# EAGLE design time-led-r1 (EAGLE 6.5.0)
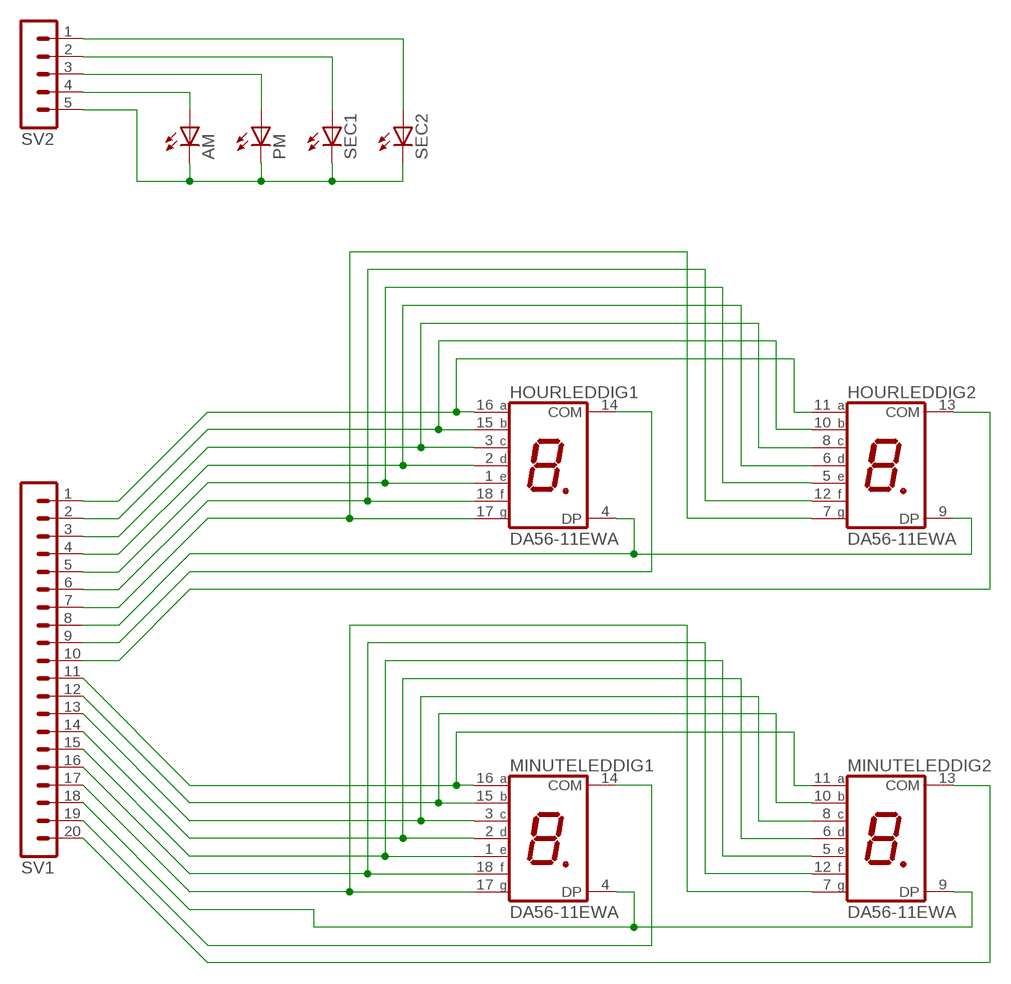
[diagram p0: schematic, sheet 1]

## Parts
AM  LED3MM  [LED3MM]
HOURLED  DA56-11EWA  [DA56]
MINUTELED  DA56-11EWA  [DA56]
PM  LED3MM  [LED3MM]
SEC1  LED3MM  [LED3MM]
SEC2  LED3MM  [LED3MM]
SV1  MA20-1W  [MA20-1W]
SV2  MA05-1  [MA05-1]

## Nets
N$1: HOURLED.11(DIG2:A) HOURLED.16(DIG1:A) SV1.1
N$2: HOURLED.10(DIG2:B) HOURLED.15(DIG1:B) SV1.2
N$3: HOURLED.3(DIG1:C) HOURLED.8(DIG2:C) SV1.3
N$4: HOURLED.2(DIG1:D) HOURLED.6(DIG2:D) SV1.4
N$5: HOURLED.1(DIG1:E) HOURLED.5(DIG2:E) SV1.5
N$6: HOURLED.12(DIG2:F) HOURLED.18(DIG1:F) SV1.6
N$7: HOURLED.7(DIG2:G) HOURLED.17(DIG1:G) SV1.7
N$8: HOURLED.4(DIG1:DP) HOURLED.9(DIG2:DP) SV1.8
N$9: MINUTELED.11(DIG2:A) MINUTELED.16(DIG1:A) SV1.11
N$10: MINUTELED.10(DIG2:B) MINUTELED.15(DIG1:B) SV1.12
N$11: MINUTELED.3(DIG1:C) MINUTELED.8(DIG2:C) SV1.13
N$12: MINUTELED.2(DIG1:D) MINUTELED.6(DIG2:D) SV1.14
N$13: MINUTELED.1(DIG1:E) MINUTELED.5(DIG2:E) SV1.15
N$14: MINUTELED.12(DIG2:F) MINUTELED.18(DIG1:F) SV1.16
N$15: MINUTELED.7(DIG2:G) MINUTELED.17(DIG1:G) SV1.17
N$16: MINUTELED.4(DIG1:DP) MINUTELED.9(DIG2:DP) SV1.18
N$17: HOURLED.13(DIG2:COM) SV1.10
N$19: AM.K(C) PM.K(C) SEC1.K(C) SEC2.K(C) SV2.5
N$20: HOURLED.14(DIG1:COM) SV1.9
N$21: AM.A SV2.4
N$22: PM.A SV2.3
N$23: SEC1.A SV2.2
N$24: SEC2.A SV2.1
N$26: MINUTELED.14(DIG1:COM) SV1.19
N$27: MINUTELED.13(DIG2:COM) SV1.20

## Library data of the parts
AM PM SEC1 SEC2 = led:LED: LED OSRAM: - CHIPLED LG R971, LG N971, LY N971, LG Q971, LY Q971, LO R971, LY R971 LH N974, LH R974 LS Q976, LO Q976, LY Q976 LO Q996 - Hyper CHIPLED LW Q18S LB Q993, LB Q99A, LB R99A - SideLED LS A670, LO A670, LY A670, LG A670, LP A670 LB A673, LV A673, LT A673, LW A673 LH A674 LY A675 LS A676, LA A676, LO A676, LY A676, LW A676 LS A679, LY A679, LG A679 - Hyper Micro SIDELED® LS Y876, LA Y876, LO Y876, LY Y876 LT Y87S - SmartLED LW L88C, LW L88S LB L89C, LB L89S, LG L890 LS L89K, LO L89K, LY L89K LS L896, LA L896, LO L896, LY L896 - TOPLED LS T670, LO T670, LY T670, LG T670, LP T670 LSG T670, LSP T670, LSY T670, LOP T670, LYG T670 LG T671, LOG T671, LSG T671 LB T673, LV T673, LT T673, LW T673 LH T674 LS T676, LA T676, LO T676, LY T676, LB T676, LH T676, LSB T676, LW T676 LB T67C, LV T67C, LT T67C, LS T67K, LO T67K, LY T67K, LW E67C LS E67B, LA E67B, LO E67B, LY E67B, LB E67C, LV E67C, LT E67C LW T67C LS T679, LY T679, LG T679 LS T770, LO T770, LY T770, LG T770, LP T770 LB T773, LV T773, LT T773, LW T773 LH T774 LS E675, LA E675, LY E675, LS T675 LS T776, LA T776, LO T776, LY T776, LB T776 LHGB T686 LT T68C, LB T68C - Hyper Mini TOPLED® LB M676 - Mini TOPLED Santana® LG M470 LS M47K, LO M47K, LY M47K Source: http://www.osram.convergy.de LUXEON: - LUMILED® LXK2-PW12-R00, LXK2-PW12-S00, LXK2-PW14-U00, LXK2-PW14-V00 LXK2-PM12-R00, LXK2-PM12-S00, LXK2-PM14-U00 LXK2-PE12-Q00, LXK2-PE12-R00, LXK2-PE12-S00, LXK2-PE14-T00, LXK2-PE14-U00 LXK2-PB12-K00, LXK2-PB12-L00, LXK2-PB12-M00, LXK2-PB14-N00, LXK2-PB14-P00, LXK2-PB14-Q00 LXK2-PR12-L00, LXK2-PR12-M00, LXK2-PR14-Q00, LXK2-PR14-R00 LXK2-PD12-Q00, LXK2-PD12-R00, LXK2-PD12-S00 LXK2-PH12-R00, LXK2-PH12-S00 LXK2-PL12-P00, LXK2-PL12-Q00, LXK2-PL12-R00 Source: www.luxeon.com KINGBRIGHT: KA-3528ASYC Source: www.kingbright.com
HOURLED MINUTELED = display-kingbright:DA56-11: 14.22mm (0.56INCH) DUAL DIGIT NUMERIC DISPLAYS Source: www.kingbright.com .. DA56-11SRWA.pdf; OC_FARNELL: unknown; OC_NEWARK: unknown
SV1 = con-lstb:MA20-1W: PIN HEADER; OC_FARNELL: unknown; OC_NEWARK: unknown
SV2 = con-lstb:MA05-1: PIN HEADER; OC_FARNELL: unknown; OC_NEWARK: unknown

## Board
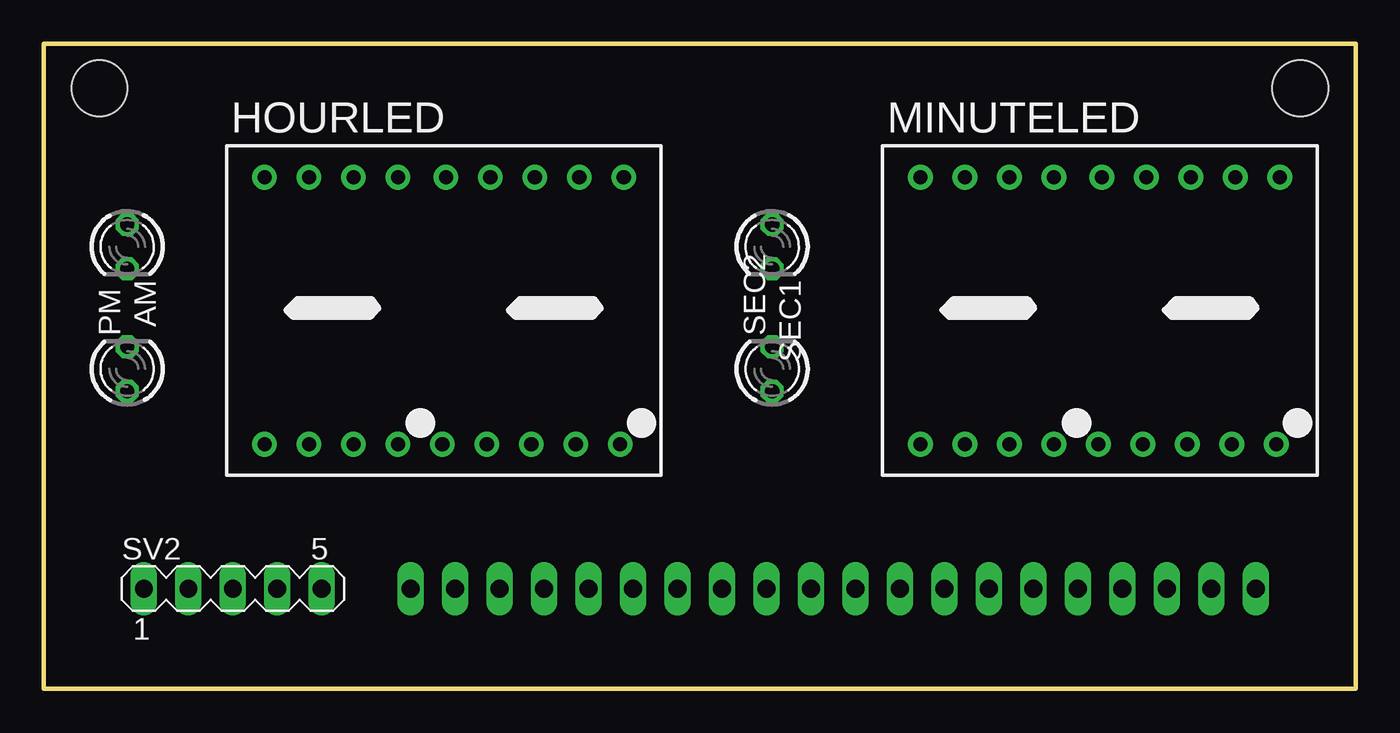
[diagram p1: board, top side]
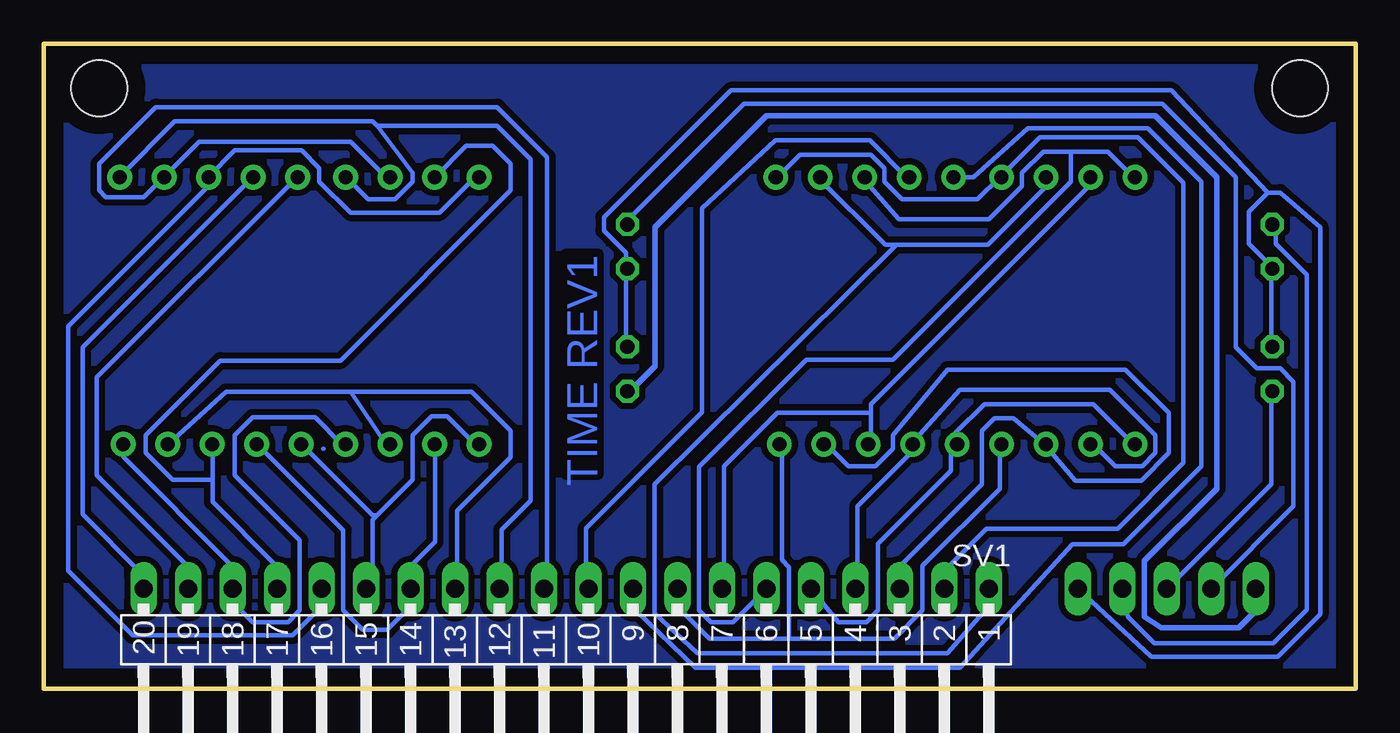
[diagram p2: board, bottom side, seen from below]

Size 74.92 x 36.82 mm. Coordinates in mm from the lower left corner, seen from the top.
Outline: 0,0 74.92,0 74.92,36.82 0,36.82 0,0
Copper layers (1*16): Top 0.035mm / dielectric 1.5mm / Bottom 0.035mm
Design rules "default *": minimum track width 10mil, minimum drill 24mil, track to track 14mil, track to pad 14mil, pad to pad 14mil, via to via 14mil, smd to smd 14mil, copper to edge 40mil, drill to drill 8mil, minimum pad ring 10mil, minimum via ring 8mil, stop-mask expansion 4mil, vias tented up to drill 0mil, thermal gap 10mil
Holes 3.2 mm at 3.17,34.29 71.75,34.29

### Footprints (pad centres in the part's own frame; a part is rotated, then mirrored left to right if it is on the bottom)
LED3MM = drill 0.813 octagon: A -1.27,0; K 1.27,0
DA56 = drill 0.8 pad 1.422: 1 -10.26,-7.62; 2 -7.72,-7.62; 3 -5.18,-7.62; 4 -2.64,-7.62; 5 -0.1,-7.62; 6 2.44,-7.62; 7 4.98,-7.62; 8 7.52,-7.62; 9 10.06,-7.62; 10 10.26,7.62; 11 7.72,7.62; 12 5.18,7.62; 13 2.64,7.62; 14 0.1,7.62; 15 -2.64,7.62; 16 -5.18,7.62; 17 -7.72,7.62; 18 -10.26,7.62
MA20-1W = drill 1.016 long: 1 -24.13,0; 2 -21.59,0; 3 -19.05,0; 4 -16.51,0; 5 -13.97,0; 6 -11.43,0; 7 -8.89,0; 8 -6.35,0; 9 -3.81,0; 10 -1.27,0; 11 1.27,0; 12 3.81,0; 13 6.35,0; 14 8.89,0; 15 11.43,0; 16 13.97,0; 17 16.51,0; 18 19.05,0; 19 21.59,0; 20 24.13,0
MA05-1 = drill 1.016 long: 1 -5.08,0; 2 -2.54,0; 3 0,0; 4 2.54,0; 5 5.08,0

### Placement (x,y rotation side)
AM  4.76,25.24 270 top
HOURLED  22.86,21.59 0 top
MINUTELED  60.33,21.59 0 top
PM  4.76,18.26 90 top
SEC1  41.59,25.24 270 top
SEC2  41.59,18.26 90 top
SV1  45.09,5.71 180 bottom
SV2  10.79,5.71 0 top

### Tracks (layer width: path | path; a pad name or v marks a point on that pad's centre or on a via)
N$1
  Bottom 0.254: 26.23,25.34 26.86,25.34 30.73,29.21 HOURLED.11 | 26.23,25.34 21.02,25.34 17.78,28.57 HOURLED.16 | 26.23,25.34 40.04,11.68 40.04,4.32 37.59,2.03 23.3,2.03 21.08,4.57 21.08,5.59 SV1.1
N$2
  Bottom 0.254: 20.32,29.21 21.59,27.94 25.91,27.94 26.92,28.96 26.92,29.72 27.69,30.48 31.75,30.48 33.02,29.21 HOURLED.10 | 20.32,29.21 18.03,31.5 12.45,31.5 9.84,28.89 9.84,12.89 13.59,9.14 21.08,9.14 23.37,6.86 23.37,5.84 SV1.2 | 20.32,29.21 HOURLED.15
N$3
  Bottom 0.254: 17.78,13.97 19.56,15.43 20.64,15.43 21.34,14.73 21.34,11.68 25.91,7.11 25.91,5.84 SV1.3 | 17.78,13.97 16,11.87 12.26,11.87 10.67,13.46 10.67,15.75 13.14,18.22 23.3,18.22 26.42,14.48 26.42,13.72 27.43,12.7 28.96,12.7 30.23,13.97 HOURLED.8 | 17.78,13.97 HOURLED.3
N$4
  Bottom 0.254: 25.4,13.97 22.61,17.08 14.03,17.08 11.43,14.48 11.43,13.46 12.19,12.7 13.72,12.7 14.99,13.97 HOURLED.2 | 25.4,13.97 25.4,13.46 28.45,10.41 28.45,5.84 SV1.4 | 25.4,13.97 HOURLED.6
N$5
  Bottom 0.254: 22.86,14.61 21.21,16.26 14.99,16.26 12.7,13.97 HOURLED.1 | SV1.5 29.53,3.81 27.94,3.81 27.27,4.48 27.27,8.29 23.11,12.45 23.11,13.72 22.86,14.61 | 22.86,14.61 HOURLED.5
N$6
  Bottom 0.254: 16.26,30.67 17.84,30.67 19.05,29.46 19.05,28.7 20.95,26.8 26.1,26.8 28.19,29.21 HOURLED.12 | 16.26,30.67 14.16,30.67 12.7,29.21 HOURLED.18 | SV1.6 35.56,3.81 36.83,3.81 37.5,4.48 37.5,12.67 31.37,18.8 26.42,18.8 16.26,28.96 16.26,30.67
N$7
  Bottom 0.254: 27.69,15.75 27.69,16.26 15.24,28.7 15.24,29.21 HOURLED.17 | 27.69,15.75 27.69,13.97 HOURLED.7 | 27.69,15.75 33.02,15.75 36.07,12.7 36.07,5.84 SV1.7
N$8
  Bottom 0.254: 32.35,2.86 36.89,2.86 38.61,4.57 38.61,5.59 SV1.8 | 32.35,2.86 26.35,2.86 24.73,4.48 24.73,7.02 20.32,11.43 20.32,13.97 HOURLED.4 | 32.35,2.86 32.35,6.95 32.77,7.37 32.77,13.97 HOURLED.9
N$9
  Bottom 0.254: 68.07,29.21 66.04,31.24 57.4,31.24 55.37,29.21 MINUTELED.16 | 68.07,29.21 69.22,28.07 71.37,28.07 71.75,28.45 71.75,29.97 68.52,33.21 49.02,33.21 46.16,30.35 46.16,6.16 SV1.11 | 68.07,29.21 MINUTELED.11
N$10
  Bottom 0.254: 55.88,32.13 56.13,32.38 67.44,32.38 70.61,29.21 MINUTELED.10 | 55.88,32.13 53.85,29.46 53.85,28.96 54.86,27.94 56.39,27.94 57.66,29.21 MINUTELED.15 | 55.88,32.13 49.02,32.13 47.12,30.23 47.12,10.73 48.77,9.08 48.77,5.84 SV1.12
N$11
  Bottom 0.254: 57.4,16.95 55.37,13.97 MINUTELED.3 | 57.4,16.95 64.52,16.95 67.82,13.97 MINUTELED.8 | 57.4,16.95 50.48,16.95 48.26,14.73 48.26,13.21 51.31,10.16 51.31,5.84 SV1.13
N$12
  Bottom 0.254: MINUTELED.2 52.58,13.97 52.58,8.38 53.85,7.11 53.85,5.84 SV1.14 54.1,5.59 54.1,4.57 55.31,3.37 56.71,3.37 57.82,4.48 57.82,9.05 62.74,13.97 MINUTELED.6
N$13
  Bottom 0.254: 55.88,9.91 56.13,9.65 56.13,6.1 SV1.15 | 55.88,9.91 53.85,11.94 53.85,14.48 52.77,15.56 51.88,15.56 50.29,13.97 MINUTELED.1 | 55.88,9.91 56.13,9.91 60.2,13.97 MINUTELED.5
N$14
  Bottom 0.254: 65.53,29.21 64.01,30.73 60.2,30.73 59.18,29.72 59.18,28.96 57.4,27.18 52.32,27.18 50.29,29.21 MINUTELED.18 | 65.53,29.21 65.53,28.7 73.53,20.7 73.53,6.73 69.85,3.05 60.71,3.05 59.18,4.57 59.18,5.59 SV1.16 | 65.53,29.21 MINUTELED.12
N$15
  Bottom 0.254: 65.28,11.94 65.28,10.67 61.72,7.11 61.72,5.84 SV1.17 | 65.28,11.94 65.28,13.97 MINUTELED.7 | 65.28,11.94 67.56,11.94 69.09,13.46 69.09,14.48 64.83,18.73 57.98,18.73 48.26,28.45 48.26,29.97 49.28,30.99 50.8,30.99 52.58,29.21 MINUTELED.17
N$16
  Bottom 0.254: MINUTELED.4 57.91,13.97 59.44,15.49 62.99,15.49 64.01,14.48 64.01,12.19 60.29,8.48 60.29,4.48 60.96,3.81 62.99,3.81 64.01,4.83 64.01,5.59 SV1.18 64.26,5.84 64.26,7.11 70.36,13.21 70.36,13.97 MINUTELED.9
N$17
  Bottom 0.254: HOURLED.13 25.65,29.21 27.75,31.3 33.15,31.3 37.34,27.43 37.34,15.78 43.94,9.18 43.94,5.84 SV1.10
N$18
  Bottom 0.254: 58.93,13.72 58.95,13.72
N$19
  Bottom 0.254: SEC2.K 41.66,19.56 41.66,23.88 SEC1.K 41.66,24.13 41.66,24.89 42.93,26.16 42.93,26.92 35.69,34.16 10.54,34.16 5.02,28.32 | PM.K 4.83,19.56 4.83,23.88 AM.K 4.83,24.13 6.1,25.4 6.1,27.24 5.02,28.32 | SV2.5 11.68,1.84 4.45,1.84 2.03,4.25 2.03,26.35 4.32,28.32 5.02,28.32
N$20
  Bottom 0.254: HOURLED.14 21.84,29.21 18.73,32 11.87,32 8.83,28.96 8.83,12.7 13.27,8.26 16.19,8.26 22.61,1.21 37.69,1.21 41.15,4.51 41.15,5.59 SV1.9
N$21
  Bottom 0.254: SV2.4 13.02,4.13 11.49,2.6 4.7,2.6 2.79,4.51 2.79,23.62 4.57,25.4 4.57,26.42 AM.A
N$22
  Bottom 0.254: SV2.3 4.83,11.68 4.83,16.76 PM.A
N$23
  Bottom 0.254: SV2.2 3.56,10.41 3.56,17.53 4.32,18.29 5.65,18.29 6.86,19.49 6.86,29.21 11.05,33.4 34.92,33.4 41.66,26.67 41.4,26.67 SEC1.A
N$24
  Bottom 0.254: 41.66,16.76 SEC2.A 41.66,17.02
  Bottom 0.305: SV2.1 5.71,4.45 6.67,3.49 11.11,3.49 12.06,4.13 12.06,7.3 7.94,11.43 7.94,29.21 11.43,32.7 33.66,32.7 40.01,26.35 40.01,18.41 41.43,16.99 SEC2.A
N$25
  pour Bottom: 0,36.2 74.93,36.2 74.93,0 0,0
N$26
  Bottom 0.254: MINUTELED.14 60.45,29.21 71.88,17.78 71.88,12.19 66.8,7.11 66.8,5.84 SV1.19
N$27
  Bottom 0.254: MINUTELED.13 62.99,29.21 72.71,19.49 72.71,9.97 69.34,6.6 69.34,5.84 SV1.20

### Text on the board
Bottom: TIME REV1